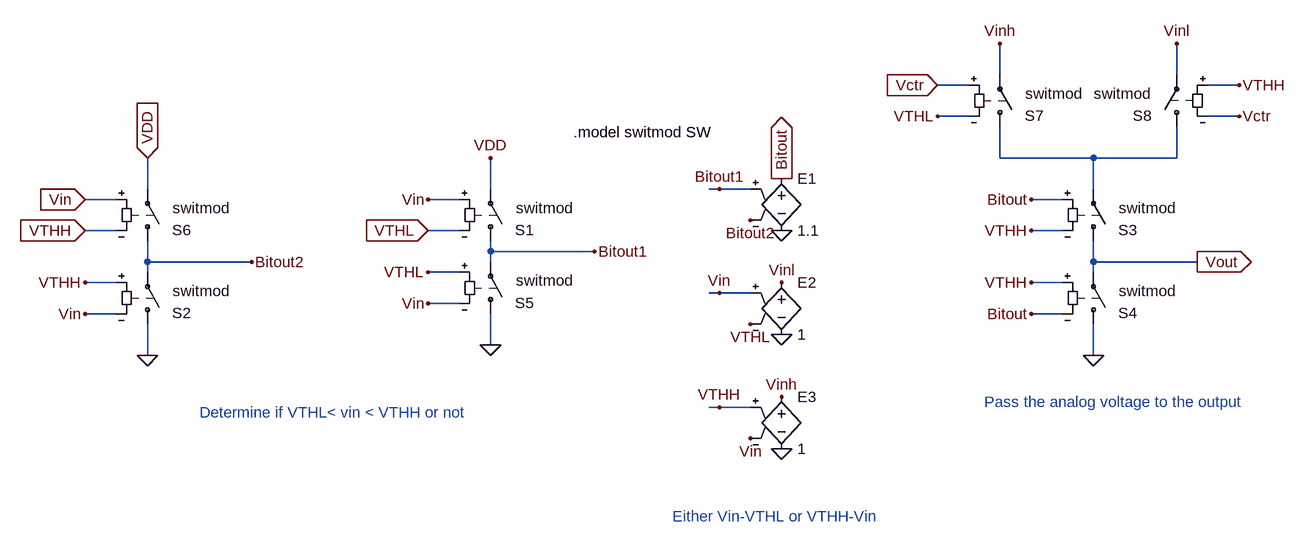
[diagram p0: schematic Folder_ADCbit.asc]
Folder_ADCbit.asc, the LTspice schematic file:
Version 4
SHEET 1 880 680
WIRE 32 -224 32 -272
WIRE 304 -224 304 -272
WIRE -16 -208 -64 -208
WIRE 400 -208 352 -208
WIRE -16 -160 -64 -160
WIRE 400 -160 352 -160
WIRE 32 -96 32 -144
WIRE 176 -96 32 -96
WIRE 304 -96 304 -144
WIRE 304 -96 176 -96
WIRE -1280 -48 -1280 -96
WIRE -752 -48 -752 -96
WIRE -400 -48 -416 -48
WIRE -352 -48 -400 -48
WIRE 176 -48 176 -96
WIRE -1328 -32 -1376 -32
WIRE -800 -32 -848 -32
WIRE 128 -32 80 -32
WIRE -1328 16 -1376 16
WIRE -800 16 -848 16
WIRE 128 16 80 16
WIRE -752 48 -752 32
WIRE -592 48 -752 48
WIRE -1280 64 -1280 32
WIRE -1120 64 -1280 64
WIRE -752 64 -752 48
WIRE 176 64 176 32
WIRE 336 64 176 64
WIRE -1280 80 -1280 64
WIRE -800 80 -848 80
WIRE 176 80 176 64
WIRE -1328 96 -1376 96
WIRE 128 96 80 96
WIRE -400 112 -416 112
WIRE -352 112 -400 112
WIRE -800 128 -848 128
WIRE -1328 144 -1376 144
WIRE 128 144 80 144
WIRE -752 192 -752 144
WIRE -1280 208 -1280 160
WIRE 176 208 176 160
WIRE -400 288 -416 288
WIRE -352 288 -400 288
FLAG -848 -32 Vin
FLAG -848 16 VTHL
IOPIN -848 16 In
FLAG -1376 96 VTHH
FLAG -1376 144 Vin
FLAG -1120 64 Bitout2
FLAG -1280 208 0
FLAG -752 -96 VDD
FLAG 80 -32 Bitout
FLAG 80 16 VTHH
FLAG 80 96 VTHH
FLAG 80 144 Bitout
FLAG 336 64 Vout
IOPIN 336 64 Out
FLAG -304 16 0
FLAG -304 176 0
FLAG -304 -64 Bitout
IOPIN -304 -64 Out
FLAG -304 96 Vinl
FLAG -352 160 VTHL
FLAG -352 0 Bitout2
FLAG -400 -48 Bitout1
FLAG -400 112 Vin
FLAG -848 80 VTHL
FLAG -848 128 Vin
FLAG -592 48 Bitout1
FLAG -752 192 0
FLAG -1376 -32 Vin
IOPIN -1376 -32 In
FLAG -1376 16 VTHH
IOPIN -1376 16 In
FLAG -1280 -96 VDD
IOPIN -1280 -96 In
FLAG 176 208 0
FLAG -304 352 0
FLAG -304 272 Vinh
FLAG -352 336 Vin
FLAG -400 288 VTHH
FLAG -64 -208 Vctr
IOPIN -64 -208 In
FLAG -64 -160 VTHL
FLAG 32 -272 Vinh
FLAG 400 -208 VTHH
FLAG 400 -160 Vctr
FLAG 304 -272 Vinl
SYMBOL sw -752 48 M180
WINDOW 3 24 -12 Left 0
WINDOW 38 39 67 Left 0
WINDOW 0 38 33 Left 0
SYMATTR Value ""
SYMATTR SpiceModel switmod
SYMATTR InstName S1
SYMBOL sw -1280 176 M180
WINDOW 3 24 -12 Left 0
WINDOW 38 39 67 Left 0
WINDOW 0 38 33 Left 0
SYMATTR Value ""
SYMATTR SpiceModel switmod
SYMATTR InstName S2
SYMBOL sw 176 48 M180
WINDOW 3 24 -12 Left 0
WINDOW 38 39 67 Left 0
WINDOW 0 38 33 Left 0
SYMATTR Value ""
SYMATTR SpiceModel switmod
SYMATTR InstName S3
SYMBOL sw 176 176 M180
WINDOW 3 24 -12 Left 0
WINDOW 38 39 67 Left 0
WINDOW 0 38 33 Left 0
SYMATTR Value ""
SYMATTR SpiceModel switmod
SYMATTR InstName S4
SYMBOL e -304 -80 R0
SYMATTR InstName E1
SYMATTR Value 1.1
SYMBOL e -304 80 R0
SYMATTR InstName E2
SYMATTR Value 1
SYMBOL sw -752 160 M180
WINDOW 3 24 -12 Left 0
WINDOW 38 39 67 Left 0
WINDOW 0 38 33 Left 0
SYMATTR Value ""
SYMATTR SpiceModel switmod
SYMATTR InstName S5
SYMBOL sw -1280 48 M180
WINDOW 3 24 -12 Left 0
WINDOW 38 39 67 Left 0
WINDOW 0 38 33 Left 0
SYMATTR Value ""
SYMATTR SpiceModel switmod
SYMATTR InstName S6
SYMBOL e -304 256 R0
SYMATTR InstName E3
SYMATTR Value 1
SYMBOL sw 32 -128 M180
WINDOW 3 24 -12 Left 0
WINDOW 38 39 67 Left 0
WINDOW 0 38 33 Left 0
SYMATTR Value ""
SYMATTR SpiceModel switmod
SYMATTR InstName S7
SYMBOL sw 304 -128 R180
WINDOW 3 24 -12 Left 0
WINDOW 38 39 67 Left 0
WINDOW 0 38 33 Left 0
SYMATTR Value ""
SYMATTR SpiceModel switmod
SYMATTR InstName S8
TEXT -1200 296 Left 0 ;Determine if VTHL< vin < VTHH or not
TEXT -472 456 Left 0 ;Either Vin-VTHL or VTHH-Vin
TEXT 8 280 Left 0 ;Pass the analog voltage to the output
TEXT -624 -136 Left 0 !.model switmod SW

The netlist it stands for:
* Folder_ADCbit.asc
S1 Bitout1 VDD Vin VTHL switmod
S2 0 Bitout2 VTHH Vin switmod
S3 Vout N001 Bitout VTHH switmod
S4 0 Vout VTHH Bitout switmod
E1 Bitout 0 Bitout1 Bitout2 1.1
E2 Vinl 0 Vin VTHL 1
S5 0 Bitout1 VTHL Vin switmod
S6 Bitout2 VDD Vin VTHH switmod
E3 Vinh 0 VTHH Vin 1
S7 N001 Vinh Vctr VTHL switmod
S8 N001 Vinl VTHH Vctr switmod
* Determine if VTHL< vin < VTHH or not
* Either Vin-VTHL or VTHH-Vin
* Pass the analog voltage to the output
.model switmod SW
.backanno
.end